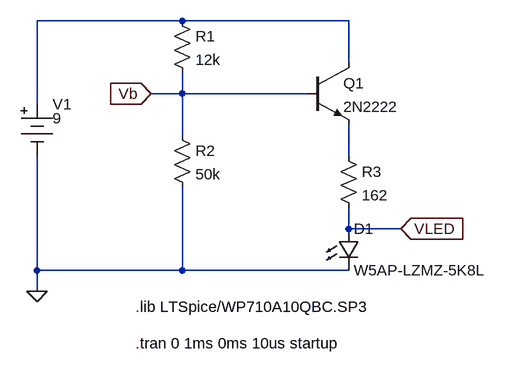
[diagram p0: schematic Photosensor.asc]
Photosensor.asc, the LTspice schematic file:
Version 4
SHEET 1 936 680
WIRE 80 -16 -144 -16
WIRE 336 -16 80 -16
WIRE 336 48 336 -16
WIRE 80 96 80 64
WIRE 80 96 32 96
WIRE 272 96 80 96
WIRE -144 112 -144 -16
WIRE 80 160 80 96
WIRE 336 192 336 144
WIRE 336 304 336 272
WIRE 416 304 336 304
WIRE -144 368 -144 192
WIRE 80 368 80 240
WIRE 80 368 -144 368
WIRE 336 368 80 368
WIRE -144 400 -144 368
FLAG -144 400 0
FLAG 32 96 Vb
IOPIN 32 96 In
FLAG 416 304 VLED
IOPIN 416 304 In
SYMBOL battery -144 96 R0
WINDOW 123 0 0 Left 2
WINDOW 3 24 38 Left 2
SYMATTR Value 9
SYMATTR InstName V1
SYMBOL res 64 -32 R0
SYMATTR InstName R1
SYMATTR Value 12k
SYMBOL res 64 144 R0
SYMATTR InstName R2
SYMATTR Value 50k
SYMBOL res 320 176 R0
SYMATTR InstName R3
SYMATTR Value 162
SYMBOL npn 272 48 R0
SYMATTR InstName Q1
SYMATTR Value 2N2222
SYMBOL LED 320 304 R0
SYMATTR InstName D1
SYMATTR Value W5AP-LZMZ-5K8L
TEXT 8 424 Left 2 !.lib LTSpice/WP710A10QBC.SP3
TEXT 8 480 Left 2 !.tran 0 1ms 0ms 10us startup

The netlist it stands for:
* Photosensor.asc
V1 N001 0 9
R1 N001 Vb 12k
R2 Vb 0 50k
R3 N002 VLED 162
Q1 N001 Vb N002 0 2N2222
D1 VLED 0 W5AP-LZMZ-5K8L
.model D D
.lib standard.dio
.model NPN NPN
.model PNP PNP
.lib standard.bjt
.lib LTSpice/WP710A10QBC.SP3
.tran 0 1ms 0ms 10us startup
.backanno
.end